# EAGLE schematic DUE shield (EAGLE 6.3)
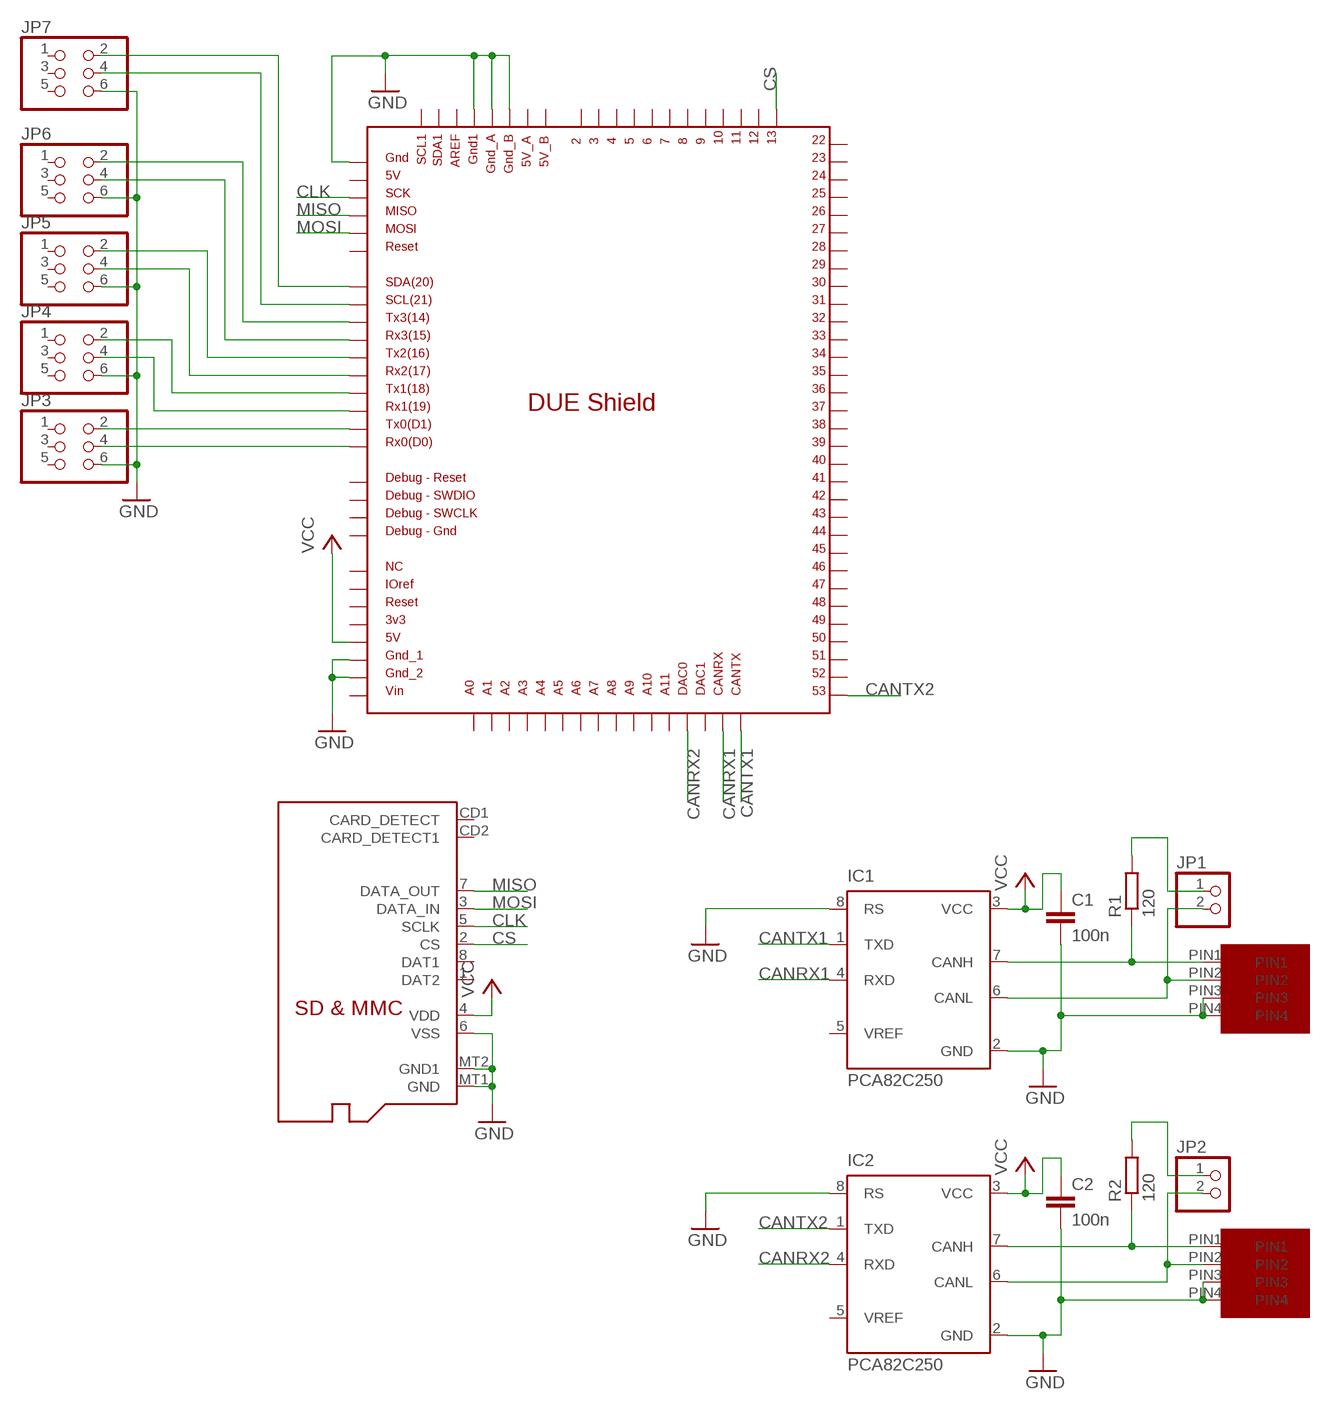
[diagram p0: schematic, sheet 1]

## Parts
C1  100n  C-EU050-024X044  [C050-024X044]
C2  100n  C-EU050-024X044  [C050-024X044]
IC1  PCA82C250  [DIL08]
IC2  PCA82C250  [DIL08]
JP1  PINHD-1X2  [1X02]
JP2  PINHD-1X2  [1X02]
JP3  PINHD-2X3  [2X03]
JP4  PINHD-2X3  [2X03]
JP5  PINHD-2X3  [2X03]
JP6  PINHD-2X3  [2X03]
JP7  PINHD-2X3  [2X03]
R1  120  R-EU_0204/7  [0204/7]
R2  120  R-EU_0204/7  [0204/7]
U$1  DUE(NORMAL)  [DUE(NORMAL)]
U$2  MICROFIT4  [MICROFIT4SOCK]
U$3  MICROFIT4  [MICROFIT4SOCK]
U$4  MICROSD  [MICROSD]

## Nets
CANRX1: IC1.4(RXD) U$1.CANRX
CANRX2: IC2.4(RXD) U$1.DAC0
CANTX1: IC1.1(TXD) U$1.CANTX
CANTX2: IC2.1(TXD) U$1.53
CLK: U$1.SCK_ICSP U$4.5(SCLK)
CS: U$1.13 U$4.2(CS)
GND: C1.2 C2.2 IC1.2(GND) IC1.8(RS) IC2.2(GND) IC2.8(RS) JP3.6 JP4.6 JP5.6 JP6.6 JP7.6 U$1.5V_ICSP U$1.GND1 U$1.GND_1 U$1.GND_2 U$1.GND_A U$1.GND_B U$2.PIN3 U$2.PIN4 U$3.PIN3 U$3.PIN4 U$4.6(VSS) U$4.MT1(GND) U$4.MT2(GND1)
MISO: U$1.MISO_ICSP U$4.7(DATA_OUT)
MOSI: U$1.MOSI_ICSP U$4.3(DATA_IN)
N$1: IC1.7(CANH) R1.1 U$2.PIN1
N$2: IC1.6(CANL) JP1.2 U$2.PIN2
N$3: JP1.1 R1.2
N$4: JP6.2 U$1.TX3
N$5: IC2.7(CANH) R2.1 U$3.PIN1
N$6: IC2.6(CANL) JP2.2 U$3.PIN2
N$7: JP2.1 R2.2
N$8: JP6.4 U$1.RX3
N$9: JP5.2 U$1.TX2
N$10: JP5.4 U$1.RX2
N$11: JP4.2 U$1.TX1
N$12: JP4.4 U$1.RX1
N$13: JP3.2 U$1.TX0
N$14: JP3.4 U$1.RX0
N$15: JP7.4 U$1.SCL
N$16: JP7.2 U$1.SDA
VCC: C1.1 C2.1 IC1.3(VCC) IC2.3(VCC) U$1.5V U$4.4(VDD)
Unconnected: IC1.5(VREF) IC2.5(VREF) JP3.1 JP3.3 JP3.5 JP4.1 JP4.3 JP4.5 JP5.1 JP5.3 JP5.5 JP6.1 JP6.3 JP6.5 JP7.1 JP7.3 JP7.5 U$1.2 U$1.3 U$1.3V3 U$1.4 U$1.5 U$1.5V_A U$1.5V_B U$1.6 U$1.7 U$1.8 U$1.9 U$1.10 U$1.11 U$1.12 U$1.22 U$1.23 U$1.24 U$1.25 U$1.26 U$1.27 U$1.28 U$1.29 U$1.30 U$1.31 U$1.32 U$1.33 U$1.34 U$1.35 U$1.36 U$1.37 U$1.38 U$1.39 U$1.40 U$1.41 U$1.42 U$1.43 U$1.44 U$1.45 U$1.46 U$1.47 U$1.48 U$1.49 U$1.50 U$1.51 U$1.52 U$1.A0 U$1.A1 U$1.A2 U$1.A3 U$1.A4 U$1.A5 U$1.A6 U$1.A7 U$1.A8 U$1.A9 U$1.A10 U$1.A11 U$1.AREF U$1.DAC1 U$1.GND_DEBUG U$1.GND_ICSP U$1.IOREF U$1.NC U$1.RESET U$1.RESET_DEBUG U$1.RESET_ICSP U$1.SCL1 U$1.SDA1 U$1.SWCLK_DEBUG U$1.SWDIO_DEBUG U$1.VIN U$4.1(DAT2) U$4.8(DAT1) U$4.CD1(CARD_DETECT) U$4.CD2(CARD_DETECT1)

## Library data of the parts
C1 C2 = rcl:C-EU: CAPACITOR, European symbol
IC1 IC2 = micro-philips:PCA82C250: CAN CONTROLLER INTERFACE; OC_FARNELL: 3692358; OC_NEWARK: unknown
JP1 JP2 = pinhead:PINHD-1X2: PIN HEADER
JP3-JP7 = pinhead:PINHD-2X3: PIN HEADER
R1 R2 = resistor:R-EU_: RESISTOR, European symbol
U$1 = DUElib130425:DUE(NORMAL)
U$2 U$3 = unicorn:MICROFIT4
U$4 = adafruit:MICROSD: Micro-SD / Transflash card holder with SPI pinout For the 3M # 2908-05WB-MG and/or 4UCON #19656 push-push type